# Altium schematic sheet datage_drv_tb_bs.SchDoc
size A4
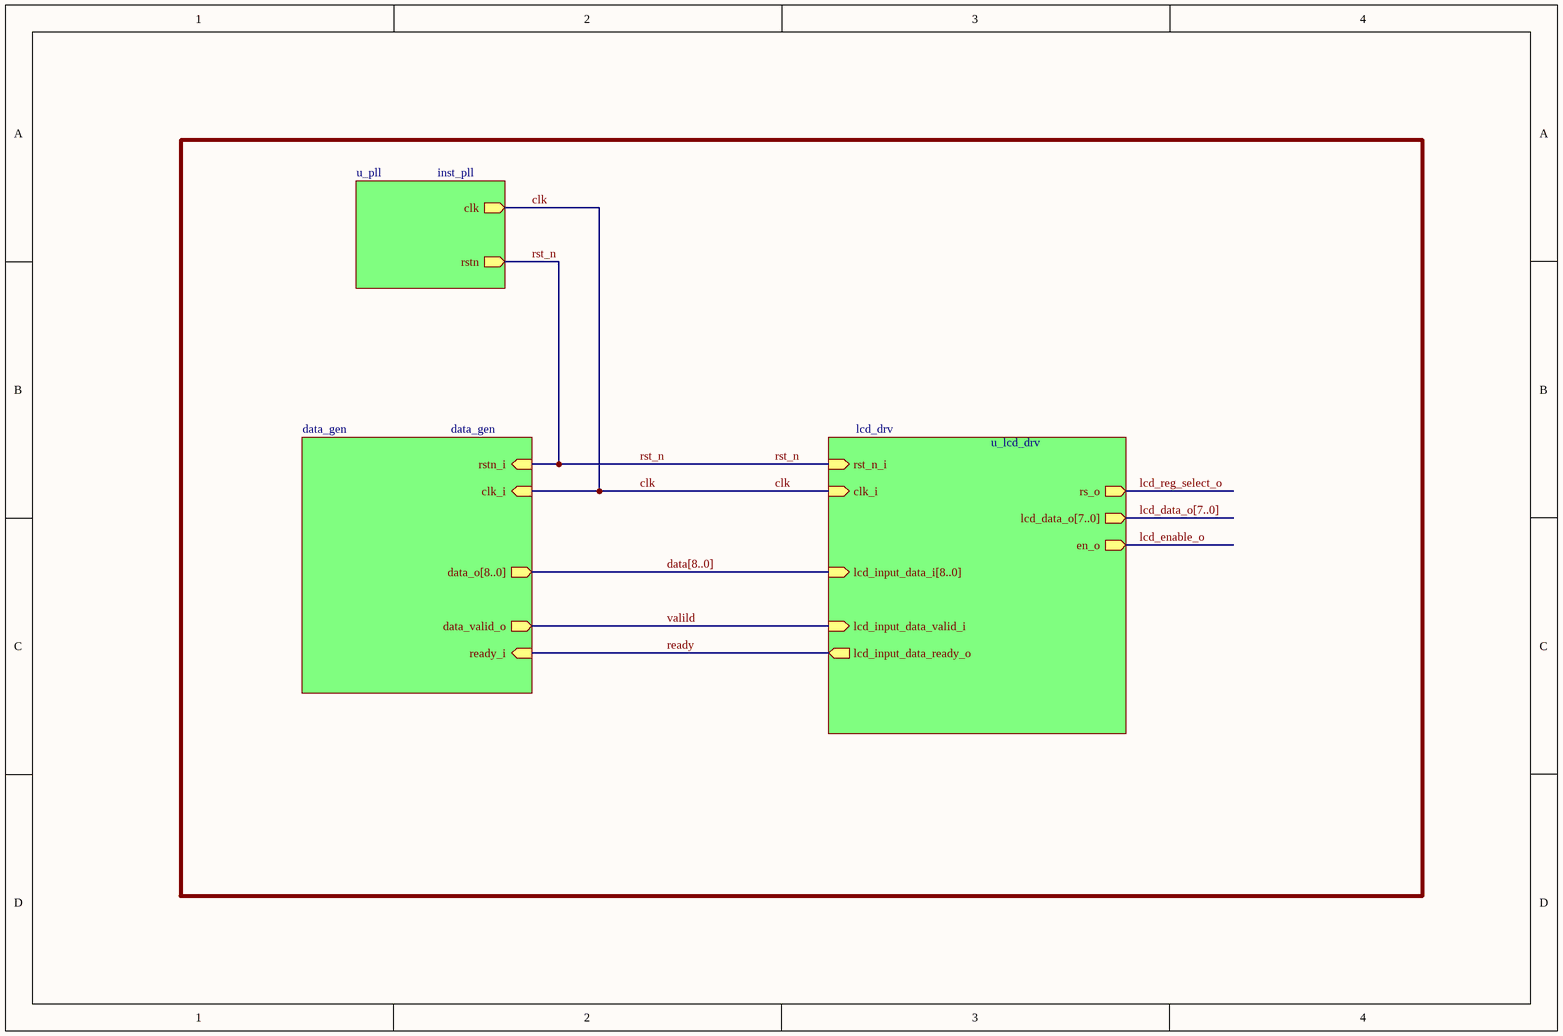
[diagram p0: datage_drv_tb_bs.SchDoc]

## Sub-sheets
data_gen = data_gen: data_o[8..0] (out), data_valid_o (out), ready_i (in), clk_i (in), rstn_i (in)
lcd_drv = u_lcd_drv: rs_o (out), lcd_data_o[7..0] (out), en_o (out), clk_i (in), lcd_input_data_i[8..0] (in), lcd_input_data_valid_i (in), lcd_input_data_ready_o (out), rst_n_i (in)
u_pll = inst_pll: clk (out), rstn (out)

## Nets
clk: sheet lcd_drv/clk_i, sheet data_gen/clk_i, sheet u_pll/clk
lcd_enable_o: sheet lcd_drv/en_o
lcd_reg_select_o: sheet lcd_drv/rs_o
ready: sheet lcd_drv/lcd_input_data_ready_o, sheet data_gen/ready_i
rst_n: sheet lcd_drv/rst_n_i, sheet data_gen/rstn_i, sheet u_pll/rstn
valild: sheet lcd_drv/lcd_input_data_valid_i, sheet data_gen/data_valid_o

## Buses and harness runs
bus data[8..0] = sheet data_gen/data_o[8..0] = sheet lcd_drv/lcd_input_data_i[8..0]
bus lcd_data_o[7..0] = sheet lcd_drv/lcd_data_o[7..0]